# Altium schematic sheet Banks_9_10.SchDoc: FPGA Motherboard for Digital Multiplexed Readout, McGill U.
size B; DocumentNumber: DfMUX6; Revision: Rev0, Prototype; SheetNumber: 6; SheetTotal: 27; PageSetup: Record=PageOptions|CenterHorizontal=True|CenterVertical=True|PrintScale=1.08|XCorrection=1.00|YCorrection=1.00|PrintKind=0|BorderSize=5000000|LeftOffset=0|BottomOffset=0|Orientation=2|PaperLength=1000|PaperWidth=1000|Scale=100|PaperSource=7|PrintQuality=-4|MediaType=1|DitherType=10|PaperKind=Tabloid|PrintScaleMode=1
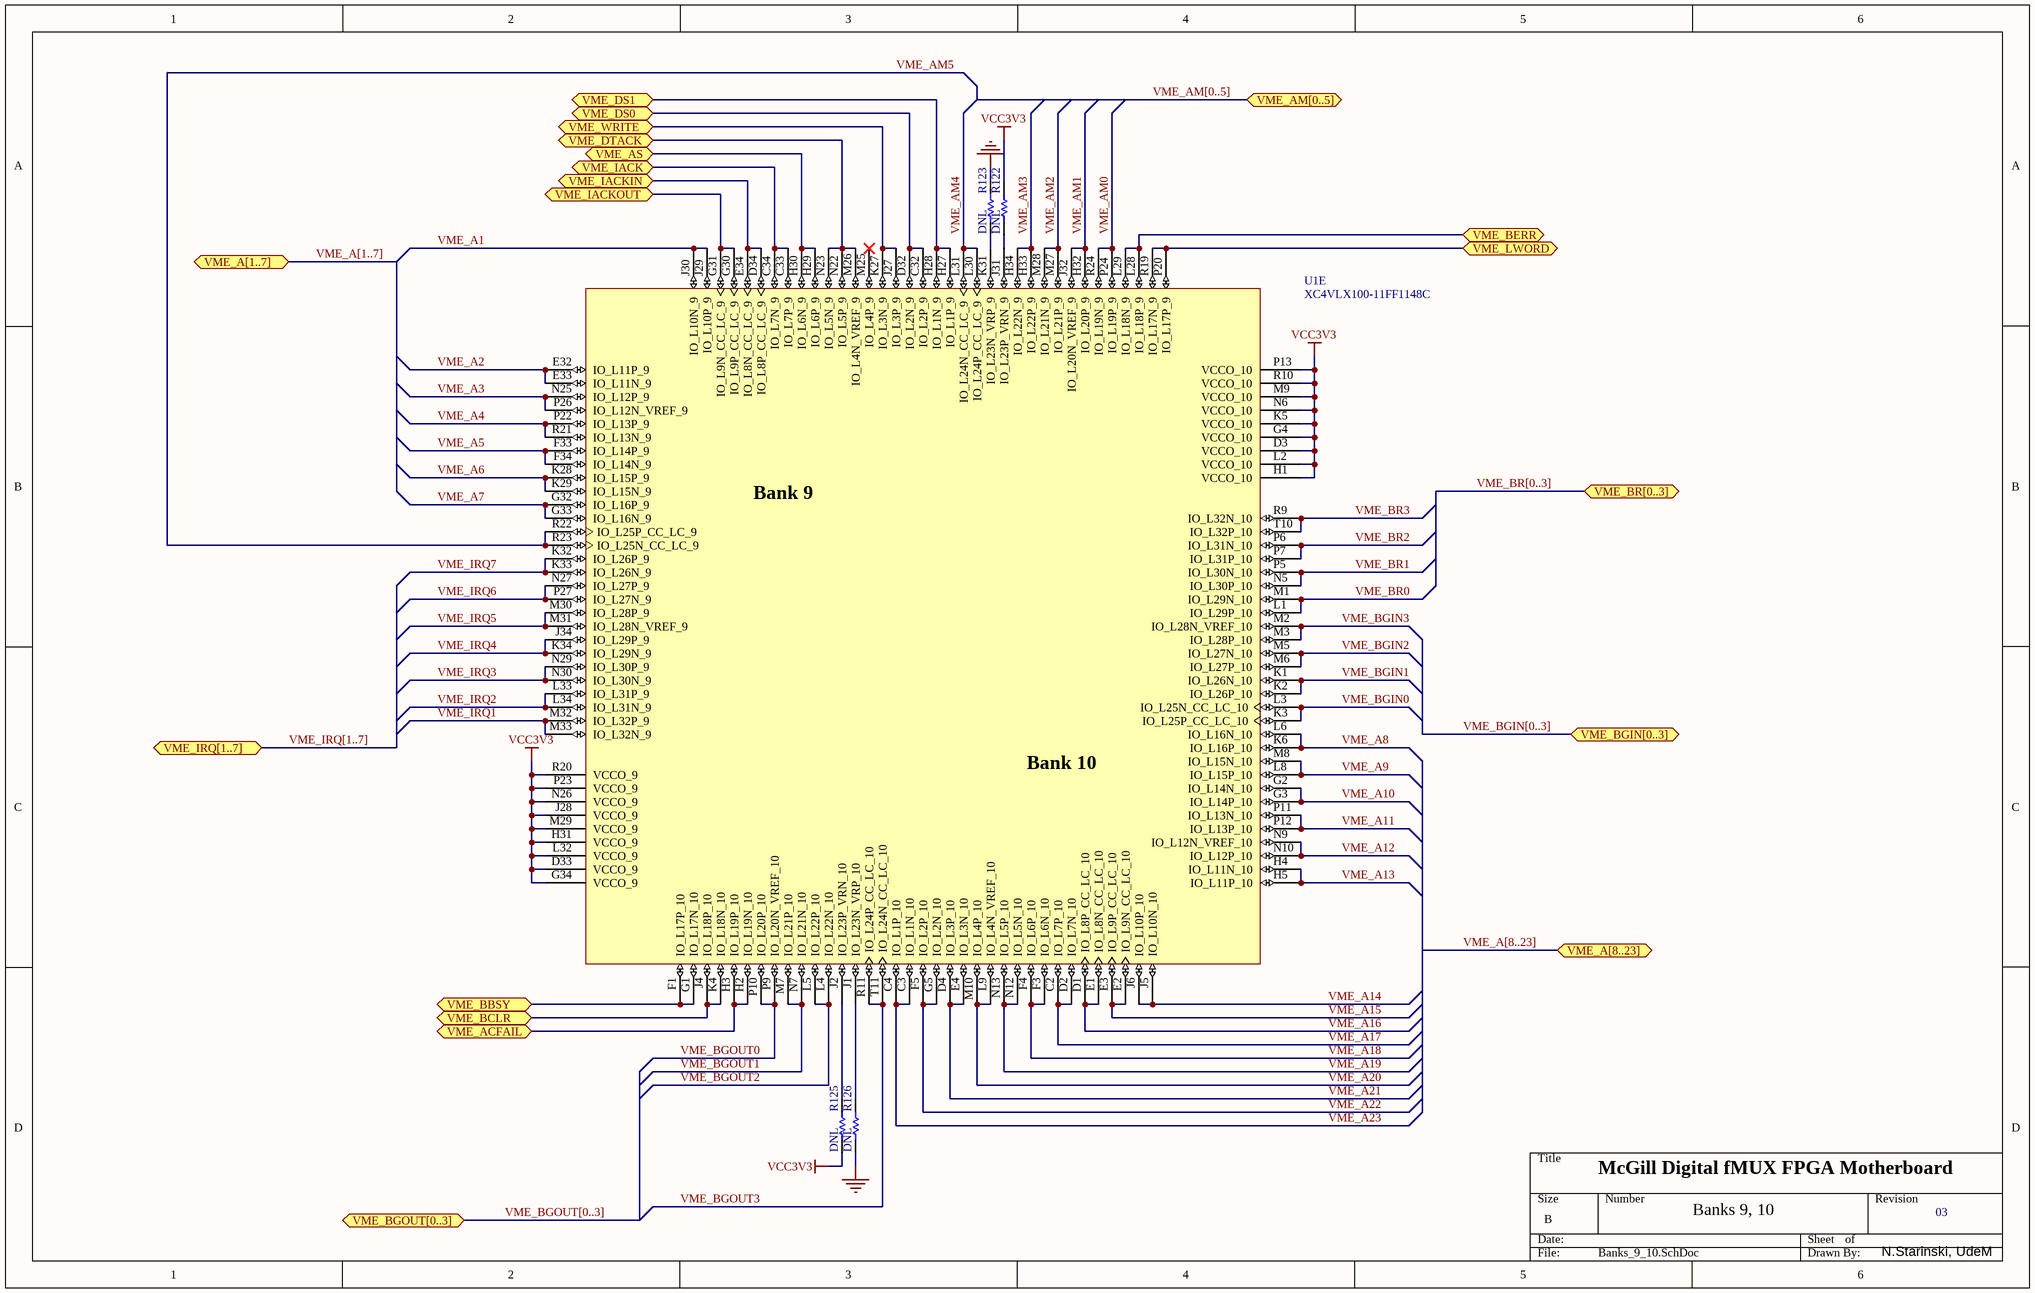
[diagram p0: Banks_9_10.SchDoc]

## Parts
R122  DNL  [CR1608-0603]
R123  DNL  [CR1608-0603]
R125  DNL  [CR1608-0603]
R126  DNL  [CR1608-0603]
U1  XC4VLX100-11FF1148C  [FF1148]  (part E of 10)

## Ports
VME_A[1..7] (bidir), VME_A[8..23] (bidir), VME_ACFAIL (bidir), VME_AM[0..5] (bidir), VME_AS (bidir), VME_BBSY (bidir), VME_BCLR (bidir), VME_BERR (bidir), VME_BGIN[0..3] (bidir), VME_BGOUT[0..3] (bidir), VME_BR[0..3] (bidir), VME_DS0 (bidir), VME_DS1 (bidir), VME_DTACK (bidir), VME_IACK (bidir), VME_IACKIN (bidir), VME_IACKOUT (bidir), VME_IRQ[1..7] (bidir), VME_LWORD (bidir), VME_WRITE (bidir)

## Nets
GND: R123.2 R126.1
VCC3V3: R122.2 R125.1 U1.D3(VCCO_10) U1.D33(VCCO_9) U1.G4(VCCO_10) U1.G34(VCCO_9) U1.H1(VCCO_10) U1.H31(VCCO_9) U1.J28(VCCO_9) U1.K5(VCCO_10) U1.L2(VCCO_10) U1.L32(VCCO_9) U1.M9(VCCO_10) U1.M29(VCCO_9) U1.N6(VCCO_10) U1.N26(VCCO_9) U1.P13(VCCO_10) U1.P23(VCCO_9) U1.R10(VCCO_10) U1.R20(VCCO_9)
VME_A1: U1.J29(IO_L10P_9) U1.J30(IO_L10N_9)
VME_A2: U1.E32(IO_L11P_9) U1.E33(IO_L11N_9)
VME_A3: U1.N25(IO_L12P_9) U1.P26(IO_L12N_VREF_9)
VME_A4: U1.P22(IO_L13P_9) U1.R21(IO_L13N_9)
VME_A5: U1.F33(IO_L14P_9) U1.F34(IO_L14N_9)
VME_A6: U1.K28(IO_L15P_9) U1.K29(IO_L15N_9)
VME_A7: U1.G32(IO_L16P_9) U1.G33(IO_L16N_9)
VME_A8: U1.K6(IO_L16P_10) U1.L6(IO_L16N_10)
VME_A9: U1.L8(IO_L15P_10) U1.M8(IO_L15N_10)
VME_A10: U1.G2(IO_L14N_10) U1.G3(IO_L14P_10)
VME_A11: U1.P11(IO_L13N_10) U1.P12(IO_L13P_10)
VME_A12: U1.N9(IO_L12N_VREF_10) U1.N10(IO_L12P_10)
VME_A13: U1.H4(IO_L11N_10) U1.H5(IO_L11P_10)
VME_A14: U1.J5(IO_L10N_10) U1.J6(IO_L10P_10)
VME_A15: U1.E2(IO_L9N_CC_LC_10) U1.E3(IO_L9P_CC_LC_10)
VME_A16: U1.D1(IO_L8P_CC_LC_10) U1.E1(IO_L8N_CC_LC_10)
VME_A17: U1.C2(IO_L7P_10) U1.D2(IO_L7N_10)
VME_A18: U1.F3(IO_L6N_10) U1.F4(IO_L6P_10)
VME_A19: U1.N12(IO_L5N_10) U1.N13(IO_L5P_10)
VME_A20: U1.L9(IO_L4N_VREF_10) U1.M10(IO_L4P_10)
VME_A21: U1.D4(IO_L3P_10) U1.E4(IO_L3N_10)
VME_A22: U1.F5(IO_L2P_10) U1.G5(IO_L2N_10)
VME_A23: U1.C3(IO_L1N_10) U1.C4(IO_L1P_10)
VME_ACFAIL: U1.H2(IO_L19N_10) U1.H3(IO_L19P_10) ; port VME_ACFAIL
VME_AM0: U1.P24(IO_L19P_9) U1.R24(IO_L19N_9)
VME_AM1: U1.H32(IO_L20P_9) U1.J32(IO_L20N_VREF_9)
VME_AM2: U1.M27(IO_L21P_9) U1.M28(IO_L21N_9)
VME_AM3: U1.H33(IO_L22P_9) U1.H34(IO_L22N_9)
VME_AM4: U1.L30(IO_L24P_CC_LC_9) U1.L31(IO_L24N_CC_LC_9)
VME_AM5: U1.R22(IO_L25P_CC_LC_9) U1.R23(IO_L25N_CC_LC_9)
VME_AS: U1.H29(IO_L6P_9) U1.H30(IO_L6N_9) ; port VME_AS
VME_BBSY: U1.F1(IO_L17P_10) U1.G1(IO_L17N_10) ; port VME_BBSY
VME_BCLR: U1.J4(IO_L18P_10) U1.K4(IO_L18N_10) ; port VME_BCLR
VME_BERR: U1.L28(IO_L18P_9) U1.L29(IO_L18N_9) ; port VME_BERR
VME_BGIN0: U1.K3(IO_L25P_CC_LC_10) U1.L3(IO_L25N_CC_LC_10)
VME_BGIN1: U1.K1(IO_L26N_10) U1.K2(IO_L26P_10)
VME_BGIN2: U1.M5(IO_L27N_10) U1.M6(IO_L27P_10)
VME_BGIN3: U1.M2(IO_L28N_VREF_10) U1.M3(IO_L28P_10)
VME_BGOUT0: U1.P9(IO_L20N_VREF_10) U1.P10(IO_L20P_10)
VME_BGOUT1: U1.M7(IO_L21P_10) U1.N7(IO_L21N_10)
VME_BGOUT2: U1.L4(IO_L22N_10) U1.L5(IO_L22P_10)
VME_BGOUT3: U1.R11(IO_L24P_CC_LC_10) U1.T11(IO_L24N_CC_LC_10)
VME_BR0: U1.L1(IO_L29P_10) U1.M1(IO_L29N_10)
VME_BR1: U1.N5(IO_L30P_10) U1.P5(IO_L30N_10)
VME_BR2: U1.P6(IO_L31N_10) U1.P7(IO_L31P_10)
VME_BR3: U1.R9(IO_L32N_10) U1.T10(IO_L32P_10)
VME_DS0: U1.C32(IO_L2P_9) U1.D32(IO_L2N_9) ; port VME_DS0
VME_DS1: U1.H27(IO_L1P_9) U1.H28(IO_L1N_9) ; port VME_DS1
VME_DTACK: U1.M26(IO_L4N_VREF_9) U1.N22(IO_L5P_9) U1.N23(IO_L5N_9) ; port VME_DTACK
VME_IACK: U1.C33(IO_L7P_9) U1.C34(IO_L7N_9) ; port VME_IACK
VME_IACKIN: U1.D34(IO_L8P_CC_LC_9) U1.E34(IO_L8N_CC_LC_9) ; port VME_IACKIN
VME_IACKOUT: U1.G30(IO_L9P_CC_LC_9) U1.G31(IO_L9N_CC_LC_9) ; port VME_IACKOUT
VME_IRQ1: U1.M32(IO_L32P_9) U1.M33(IO_L32N_9)
VME_IRQ2: U1.L33(IO_L31P_9) U1.L34(IO_L31N_9)
VME_IRQ3: U1.N29(IO_L30P_9) U1.N30(IO_L30N_9)
VME_IRQ4: U1.J34(IO_L29P_9) U1.K34(IO_L29N_9)
VME_IRQ5: U1.M30(IO_L28P_9) U1.M31(IO_L28N_VREF_9)
VME_IRQ6: U1.N27(IO_L27P_9) U1.P27(IO_L27N_9)
VME_IRQ7: U1.K32(IO_L26P_9) U1.K33(IO_L26N_9)
VME_LWORD: U1.P20(IO_L17P_9) U1.R19(IO_L17N_9) ; port VME_LWORD
VME_WRITE: U1.J27(IO_L3P_9) U1.K27(IO_L3N_9) ; port VME_WRITE
NetR122_1: R122.1 U1.J31(IO_L23P_VRN_9)
NetR123_1: R123.1 U1.K31(IO_L23N_VRP_9)
NetR125_2: R125.2 U1.J2(IO_L23P_VRN_10)
NetR126_2: R126.2 U1.J1(IO_L23N_VRP_10)

Not connected (* = marked no-connect by the designer): U1 M25(IO_L4P_9)*

## Buses and harness runs
bus VME_A[1..7] = port VME_A[1..7]
bus VME_A[8..23] = port VME_A[8..23]
bus VME_AM[0..5] = port VME_AM[0..5]
bus VME_BGIN[0..3] = port VME_BGIN[0..3]
bus VME_BGOUT[0..3] = port VME_BGOUT[0..3]
bus VME_BR[0..3] = port VME_BR[0..3]
bus VME_IRQ[1..7] = port VME_IRQ[1..7]

## Notes on the sheet
- McGill Digital fMUX FPGA Motherboard
- Banks 9, 10
- 03
- N.Starinski, UdeM
- (in symbol XC4VLX100-11FF1148C, part E) Bank 9; Bank 10

## Library data of the parts
R122 R123 R125 R126 = Res Semi: Semiconductor Resistor; Published: 8-Jun-2000; LatestRevisionDate: 17-Jul-2002; LatestRevisionNote: Re-released for DXP Platform.; Publisher: Altium Limited
U1 = XC4VLX100-11FF1148C: Xilinx Virtex-4 LX Platform FPGA, 1148-Ball FFBGA, Speed Grade 11, 768 User I/Os, Commercial Grade; PackageDocument: ver1.0, Oct-2002; Published: 13-Dec-2004; LatestRevisionDate: 4-Mar-2005; LatestRevisionNote: D_IN & CS_B pins changed from I/O to Input. DOUT_BUSY pin changed from I/O to Output.; DatasheetDocument: ver1.2, Dec-2004; PackageReference: FF1148; Publisher: Altium Limited; ComponentLink2Description: Virtex-4 Overview; ComponentLink2URL: http://www.xilinx.com/products/virtex4/overview.htm; ComponentLink3Description: Datasheet; ComponentLink3URL: http://direct.xilinx.com/bvdocs/userguides/ug075.pdf; Code_JEDEC: MS-034-AAR-1